# Altium schematic sheet RADC-RS485-S04-V00.SchDoc
size A3; SheetNumber: 8; SheetTotal: 8
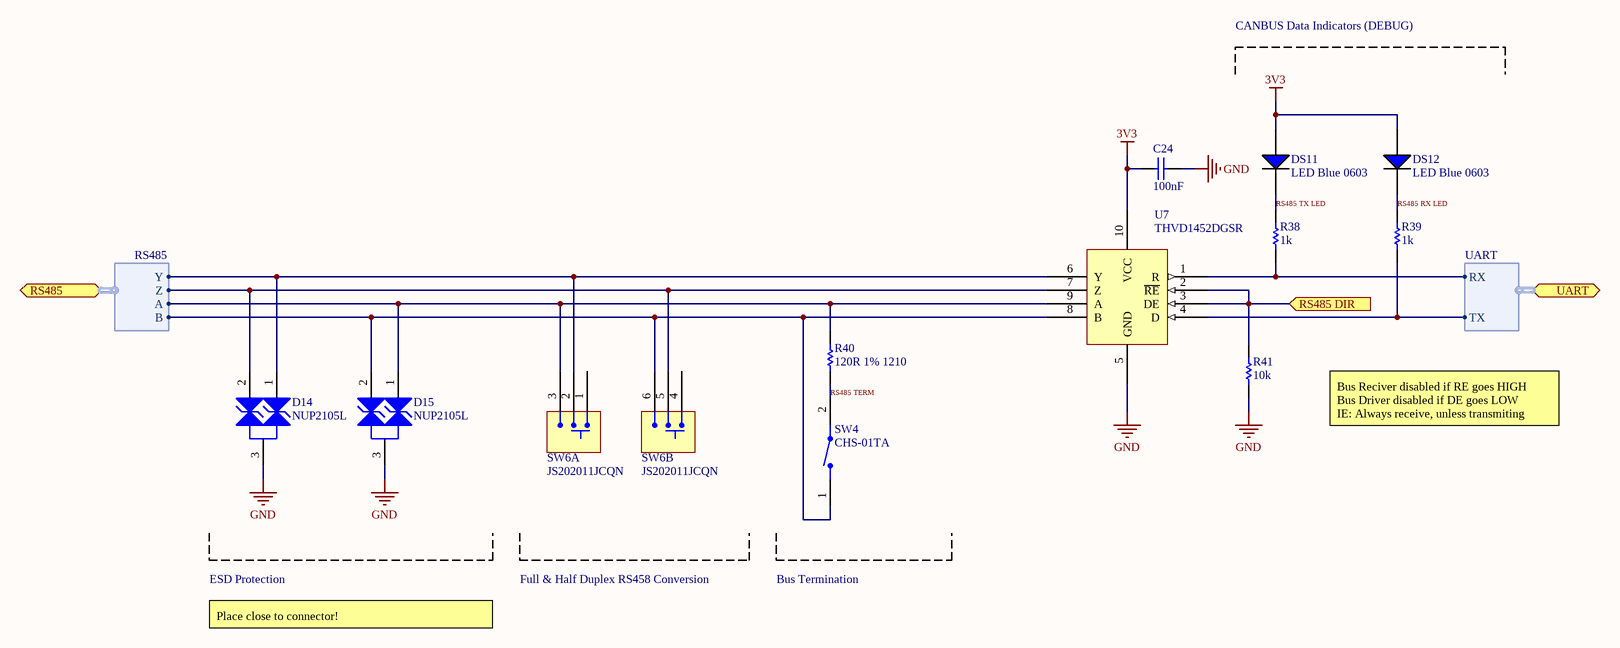
[diagram p0: RADC-RS485-S04-V00.SchDoc]

## Parts
C24  100nF  [Cap_Ceramic_0603]
D14  NUP2105L  [NUP2105L]
D15  NUP2105L  [NUP2105L]
DS11  LED Blue 0603  [LED BLUE 0603]
DS12  LED Blue 0603  [LED BLUE 0603]
R38  1k  [Res_ThinFilm_0603]
R39  1k  [Res_ThinFilm_0603]
R40  120R 1% 1210  [Res_ThinFilm_1210]
R41  10k  [Res_ThinFilm_0603]
SW4  CHS-01TA  [CHS-01TA]
SW6  JS202011JCQN  [JS202011JCQN]  (parts A,B of 2)
U7  THVD1452DGSR  [10-VSSOP]

## Ports
RS485 (bidir, harness RS485), RS485 DIR (in), UART (bidir, harness UART)

## Harnesses
RS485: Y, Z, A, B
UART: TX, RX

## Nets
3V3: C24.1 DS11.1(A) DS12.1(A) U7.10(VCC)
GND: C24.2 D14.3 D15.3 R41.1 U7.5(GND)
RS485 DIR: R41.2 U7.2(~{RE}) U7.3(DE) ; port RS485 DIR
RS485 RX LED: DS12.2(C) R39.2
RS485 TERM: R40.1 SW4.2
RS485 TX LED: DS11.2(C) R38.2
NetD14_1: D14.1 SW6.2 U7.6(Y) ; port RS485.Y
NetD14_2: D14.2 SW6.5 U7.7(Z) ; port RS485.Z
NetD15_1: D15.1 R40.2 SW6.3 U7.9(A) ; port RS485.A
NetD15_2: D15.2 SW4.1 SW6.6 U7.8(B) ; port RS485.B
NetR38_1: R38.1 U7.1(R) ; port UART.RX
NetR39_1: R39.1 U7.4(D) ; port UART.TX

Not connected (* = marked no-connect by the designer): SW6 1 4

## Notes on the sheet
- CANBUS Data Indicators (DEBUG)
- Bus Reciver disabled if RE goes HIGH
  Bus Driver disabled if DE goes LOW
  IE: Always receive, unless transmiting
- ESD Protection
- Place close to connector!
- Full & Half Duplex RS458 Conversion
- Bus Termination
- Revision History:
- Sheet Title:
- Rev
- Date
- Description
- Project:
- Size:
- Drawn By:
- A3
- Number:
- Revision:
- Sheet
- Version:
- of
- QUT Motorsport
- O-120, Gardens Point
- 2 George Street
- Brisbane, QLD 4000
- Australia
- Print Date:
- Print Time:
- File Name:

## Library data of the parts
C24 = 100nF 50V 5% X7R 0603: Capacitor, Ceramic, SMD, 100nF, 50V, 5%, X7R, 0603
R38 R39 = 1k 5% 0603: Resistor, SMD, 1k, 0.1W, 5%, 0603
R40 = 120R 1% 1210: Resistor, SMD, 120R, 0.25W, 1%, 1210
R41 = 10k 5% 0603: Resistor, SMD, 10k, 0.1W, 5%, 0603
SW4 = CHS-01TA: Dip Switch SPST 1 Position Surface Mount Slide (Standard) Actuator 100mA 6VDC
SW6 = SLIDE DPDT JS202011JCQN
U7 = THVD1452DGSR: 1/1 Transceiver Full RS485 10-VSSOP
D14 D15 = NUP2105L: ComponentLink1Description: Datasheet; ComponentLink1URL: https://www.onsemi.cn/PowerSolutions/document/NUP2105L-D.PDF; ComponentLink2Description: LCSC; ComponentLink2URL: https://lcsc.com/product-detail/TVS_ON-Semiconductor-NUP2105LT1G_C14486.html; ComponentLink3Description: Digikey; ComponentLink3URL: https://www.digikey.com.au/product-detail/en/on-semiconductor/SZNUP2105LT1G/SZNUP2105LT1GOSCT-ND/3487669